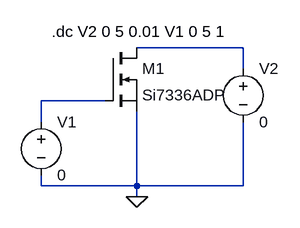
[diagram p0: schematic s1041555-hw3.asc]
s1041555-hw3.asc, the LTspice schematic file:
Version 4
SHEET 1 880 680
WIRE 288 32 128 32
WIRE 288 64 288 32
WIRE 80 112 -16 112
WIRE -16 144 -16 112
WIRE -16 240 -16 224
WIRE 128 240 128 128
WIRE 128 240 -16 240
WIRE 288 240 288 144
WIRE 288 240 128 240
WIRE 128 256 128 240
FLAG 128 256 0
SYMBOL voltage -16 128 R0
WINDOW 123 0 0 Left 2
WINDOW 39 0 0 Left 2
SYMATTR InstName V1
SYMATTR Value 0
SYMBOL voltage 288 48 R0
WINDOW 123 0 0 Left 2
WINDOW 39 0 0 Left 2
SYMATTR InstName V2
SYMATTR Value 0
SYMBOL nmos 80 32 R0
SYMATTR InstName M1
SYMATTR Value Si7336ADP
TEXT 0 8 Left 2 !.dc V2 0 5 0.01 V1 0 5 1

The netlist it stands for:
* s1041555-hw3.asc
V1 N002 0 0
V2 N001 0 0
M1 N001 N002 0 0 Si7336ADP
.model NMOS NMOS
.model PMOS PMOS
.lib standard.mos
.dc V2 0 5 0.01 V1 0 5 1
.backanno
.end